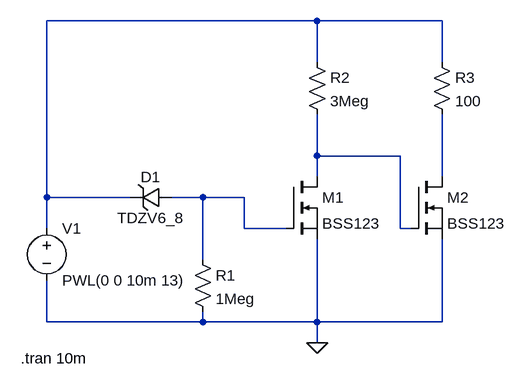
[diagram p0: schematic lowVoltageDet.asc]
lowVoltageDet.asc, the LTspice schematic file:
Version 4
SHEET 1 1528 1364
WIRE 976 224 560 224
WIRE 1168 224 976 224
WIRE 976 288 976 224
WIRE 1168 288 1168 224
WIRE 976 432 976 368
WIRE 1104 432 976 432
WIRE 976 464 976 432
WIRE 1168 464 1168 368
WIRE 560 496 560 224
WIRE 688 496 560 496
WIRE 800 496 752 496
WIRE 864 496 800 496
WIRE 560 544 560 496
WIRE 864 544 864 496
WIRE 928 544 864 544
WIRE 1104 544 1104 432
WIRE 1120 544 1104 544
WIRE 800 592 800 496
WIRE 560 688 560 624
WIRE 800 688 800 672
WIRE 800 688 560 688
WIRE 976 688 976 560
WIRE 976 688 800 688
WIRE 1168 688 1168 560
WIRE 1168 688 976 688
WIRE 976 720 976 688
FLAG 976 720 0
SYMBOL nmos 928 464 R0
SYMATTR InstName M1
SYMATTR Value BSS123
SYMBOL res 784 576 R0
SYMATTR InstName R1
SYMATTR Value 1Meg
SYMBOL zener 752 480 R90
WINDOW 0 0 32 VBottom 2
WINDOW 3 32 32 VTop 2
SYMATTR InstName D1
SYMATTR Value TDZV6_8
SYMATTR Description Diode
SYMATTR Type diode
SYMBOL voltage 560 528 R0
WINDOW 123 0 0 Left 0
WINDOW 39 0 0 Left 0
SYMATTR InstName V1
SYMATTR Value PWL(0 0 10m 13)
SYMBOL res 960 272 R0
SYMATTR InstName R2
SYMATTR Value 3Meg
SYMBOL nmos 1120 464 R0
SYMATTR InstName M2
SYMATTR Value BSS123
SYMBOL res 1152 272 R0
SYMATTR InstName R3
SYMATTR Value 100
TEXT 520 744 Left 2 !.tran 10m

The netlist it stands for:
* lowVoltageDet.asc
M1 N002 N004 0 0 BSS123
R1 N004 0 1Meg
D1 N004 N001 TDZV6_8
V1 N001 0 PWL(0 0 10m 13)
R2 N001 N002 3Meg
M2 N003 N002 0 0 BSS123
R3 N001 N003 100
.model D D
.lib standard.dio
.model NMOS NMOS
.model PMOS PMOS
.lib standard.mos
.tran 10m
.backanno
.end